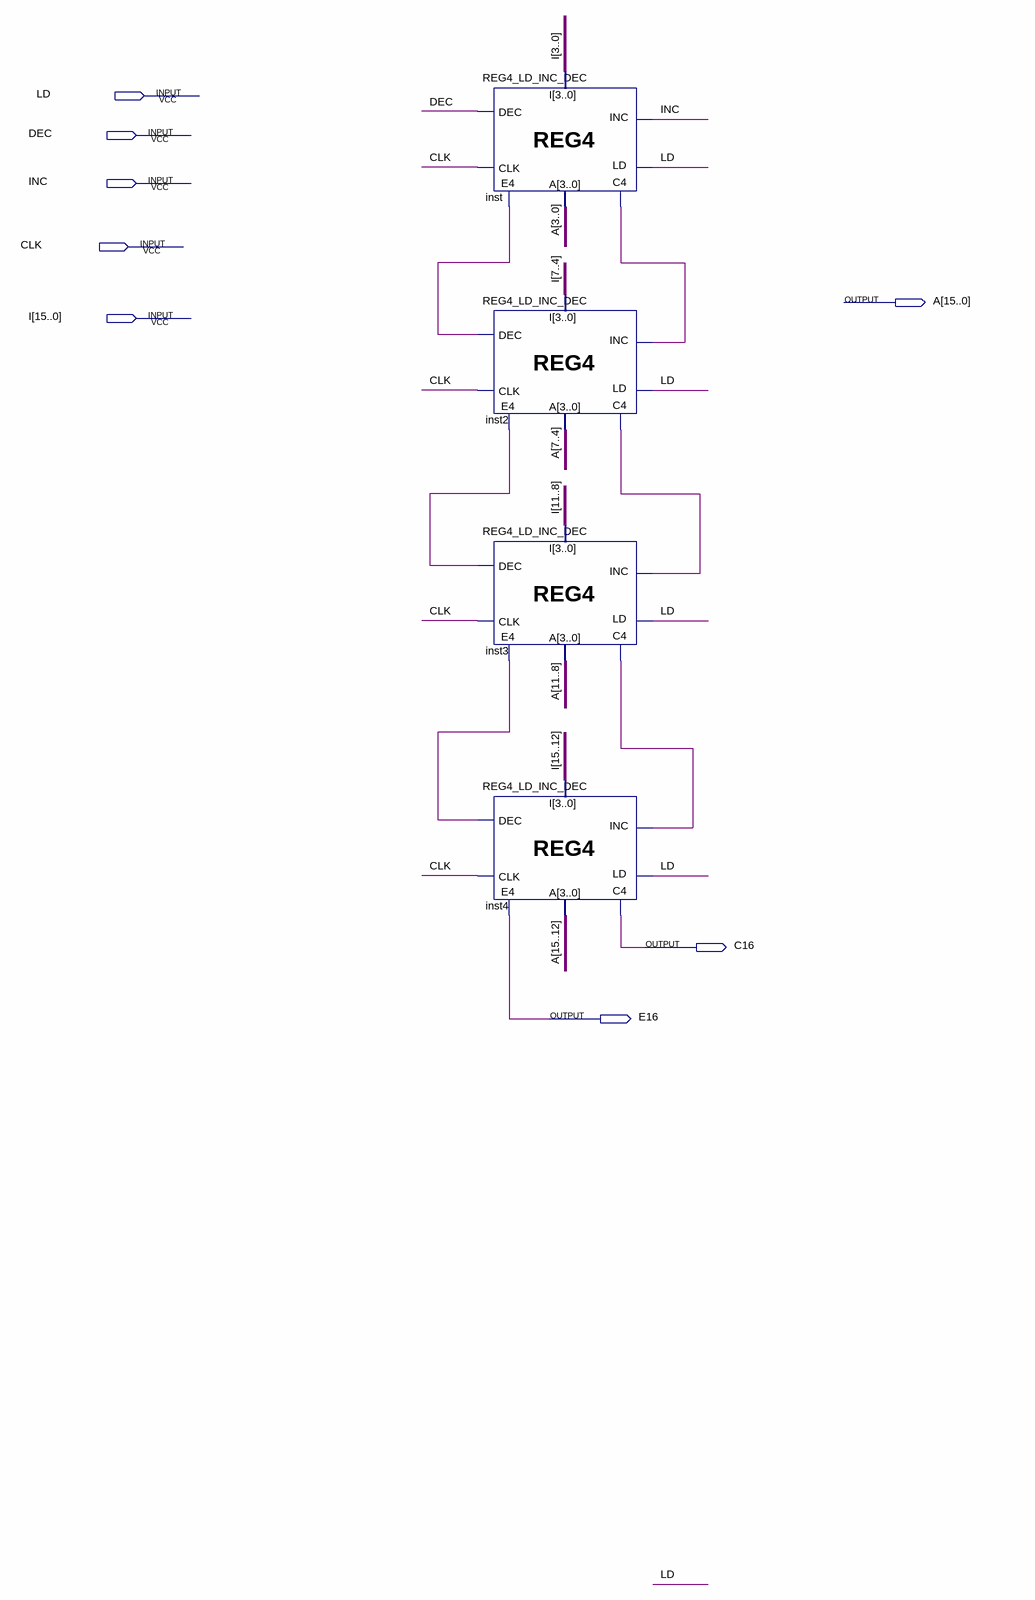
[diagram p0: schematic sheet]
// Quartus schematic REG16_LD_INC_DEC.bdf as structural Verilog: 4 symbols, 8 pins
module REG16_LD_INC_DEC (
  input  LD,
  input  DEC,
  input  INC,
  input  CLK,
  input  [15:0] I,
  output [15:0] A,
  output C16,
  output E16
);

  wire inst2_c4, inst2_e4, inst3_c4, inst3_e4, inst_c4, inst_e4;

  REG4_LD_INC_DEC inst (.LD(LD), .DEC(DEC), .INC(INC), .CLK(CLK), .I(I[3:0]), .A(A[3:0]), .C4(inst_c4), .E4(inst_e4));
  REG4_LD_INC_DEC inst2 (
    .LD(LD), .DEC(inst_e4), .INC(inst_c4), .CLK(CLK), .I(I[7:4]), .A(A[7:4]), .C4(inst2_c4), .E4(inst2_e4));
  REG4_LD_INC_DEC inst3 (
    .LD(LD), .DEC(inst2_e4), .INC(inst2_c4), .CLK(CLK), .I(I[11:8]), .A(A[11:8]), .C4(inst3_c4), .E4(inst3_e4));
  REG4_LD_INC_DEC inst4 (
    .LD(LD), .DEC(inst3_e4), .INC(inst3_c4), .CLK(CLK), .I(I[15:12]), .A(A[15:12]), .C4(C16), .E4(E16));
endmodule
